# Altium schematic sheet AmplifierDclass_Bridge.SchDoc
size 420 x 297 mm; DocumentNumber: Введите номер платы + Э3; SheetNumber: номер страницы; Format: A3
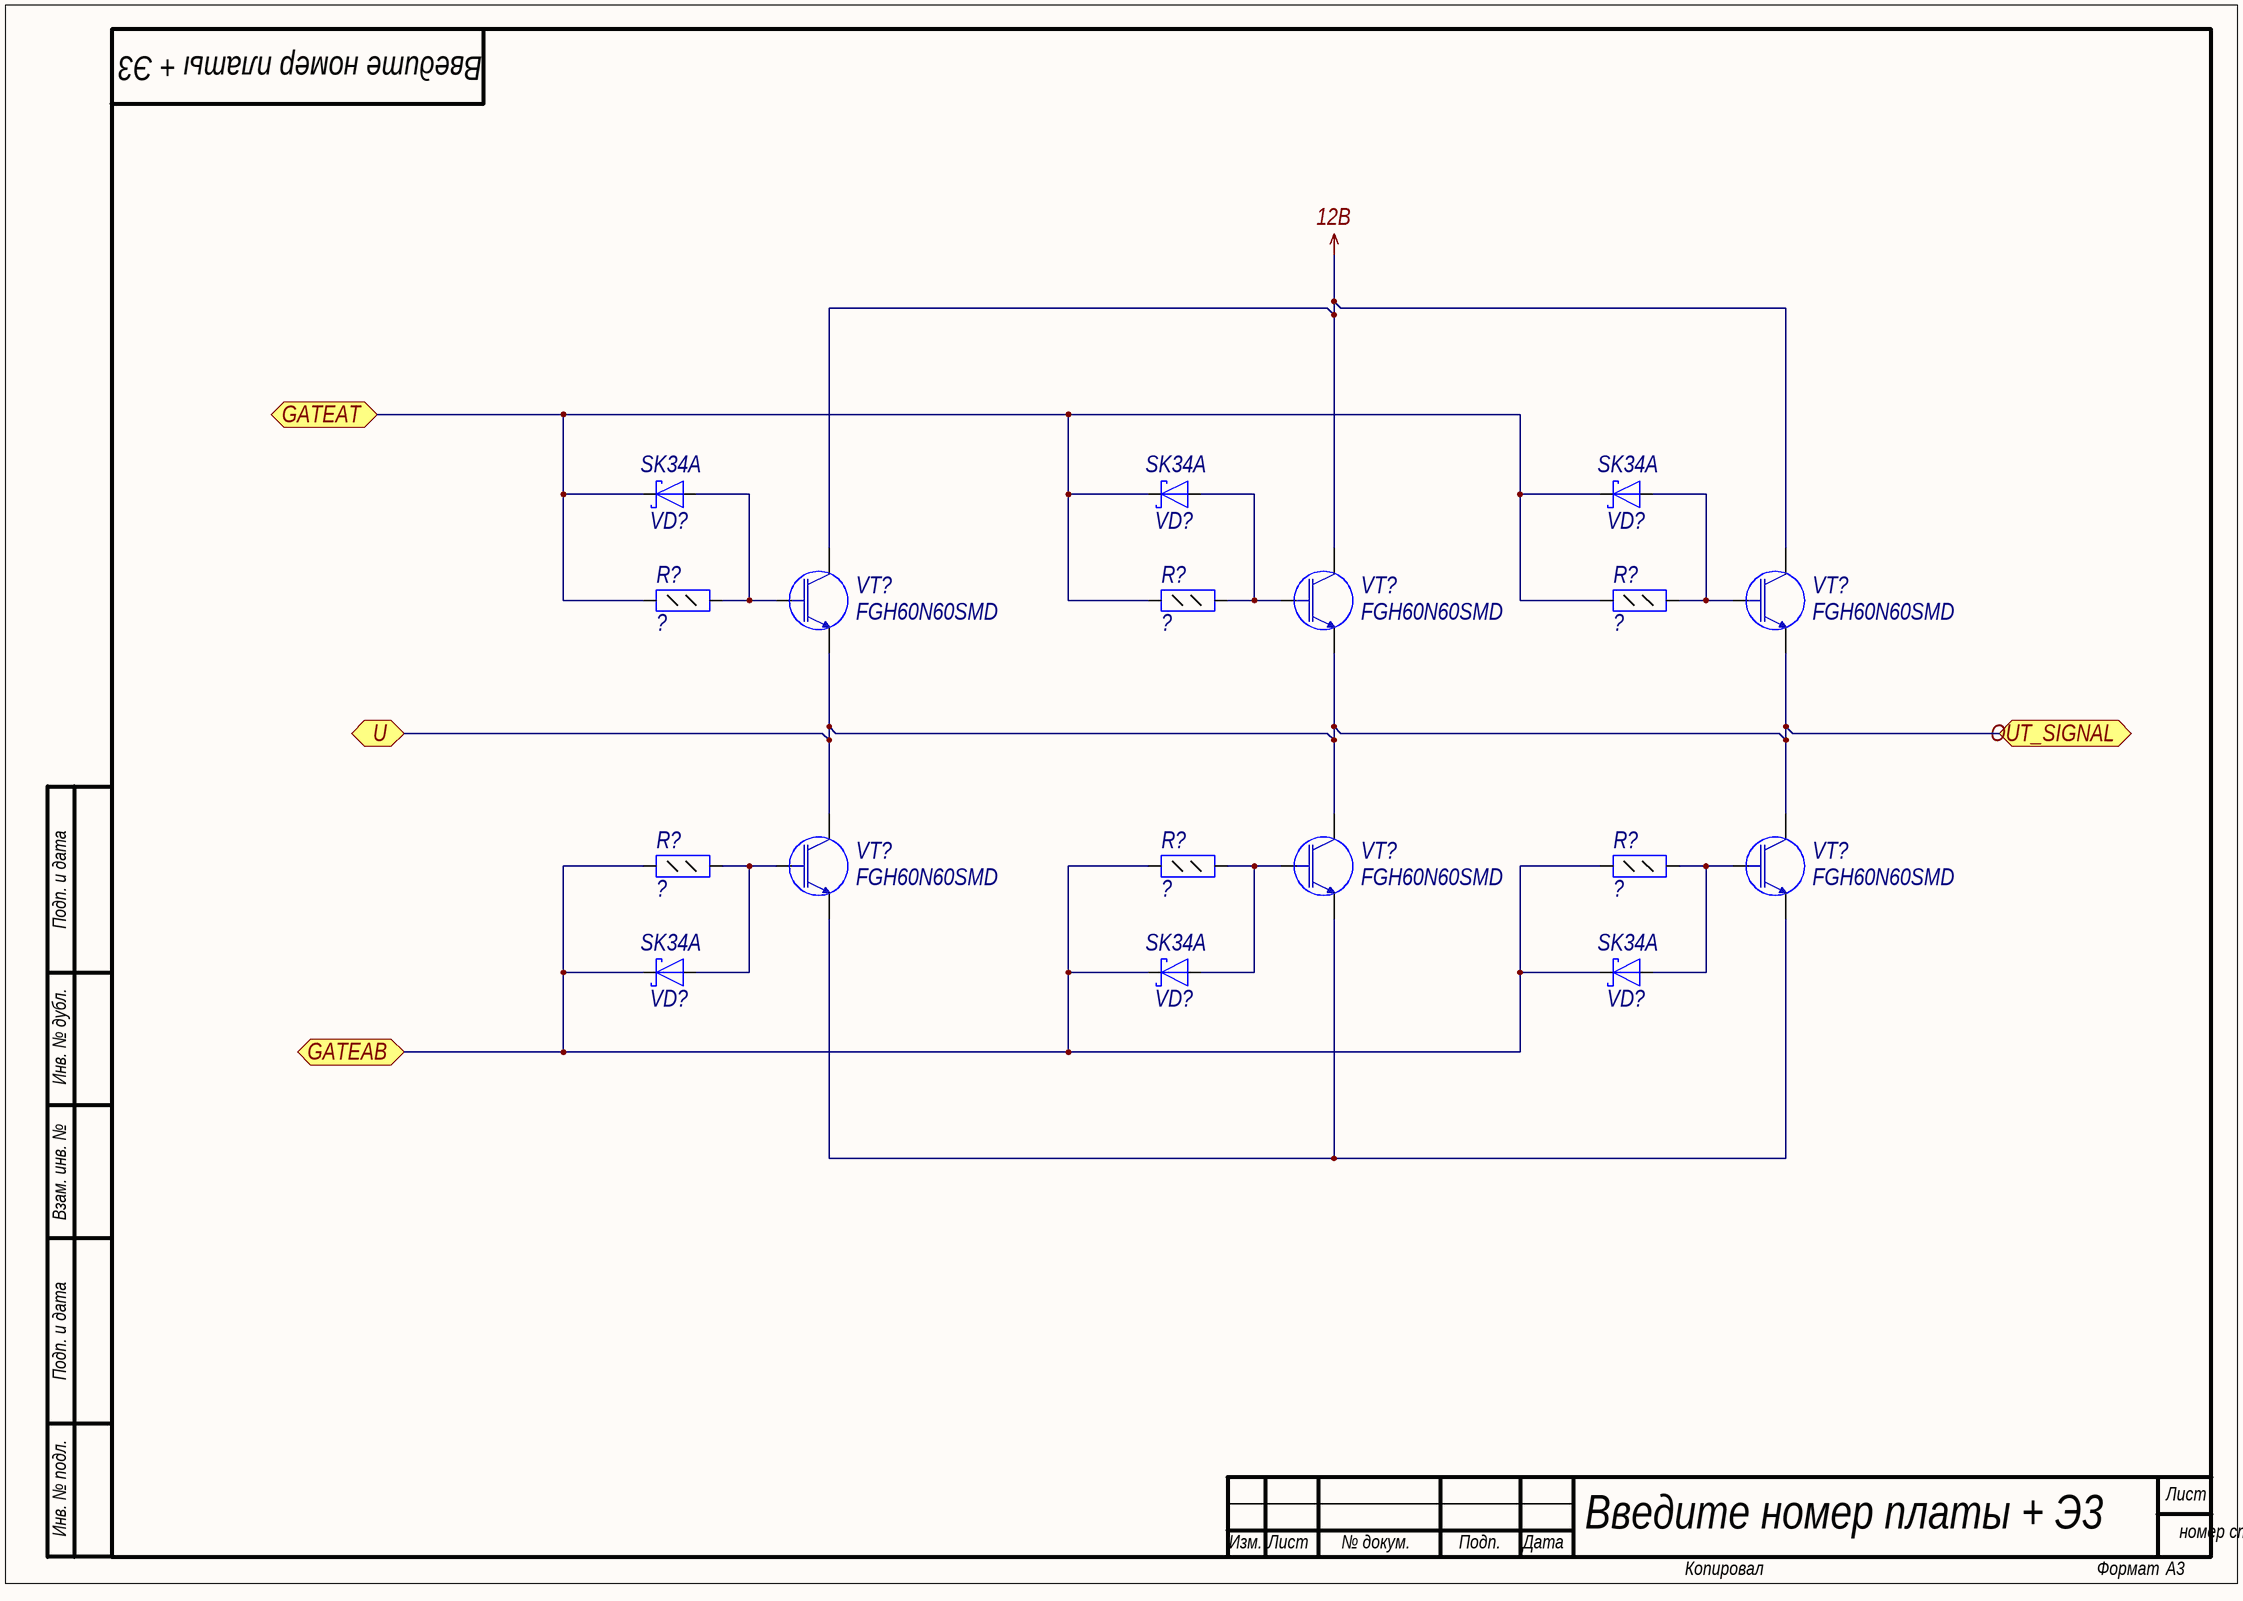
[diagram p0: AmplifierDclass_Bridge.SchDoc]

## Parts
(Parts that share a designator on the sheet are numbered #1, #2 ... from top to bottom, then left to right.)
R?#1  Resistor_0,125Вт  [R0805]  (value not drawn)
R?#2  Resistor_0,125Вт  [R0805]  (value not drawn)
R?#3  Resistor_0,125Вт  [R0805]  (value not drawn)
R?#4  Resistor_0,125Вт  [R0805]  (value not drawn)
R?#5  Resistor_0,125Вт  [R0805]  (value not drawn)
R?#6  Resistor_0,125Вт  [R0805]  (value not drawn)
VD?#1  Part Number: SK34A  [SMA]  (hidden comment: DiodeSchottky)
VD?#2  Part Number: SK34A  [SMA]  (hidden comment: DiodeSchottky)
VD?#3  Part Number: SK34A  [SMA]  (hidden comment: DiodeSchottky)
VD?#4  Part Number: SK34A  [SMA]  (hidden comment: DiodeSchottky)
VD?#5  Part Number: SK34A  [SMA]  (hidden comment: DiodeSchottky)
VD?#6  Part Number: SK34A  [SMA]  (hidden comment: DiodeSchottky)
VT?#1  Part Number: FGH60N60SMD  [TO-247_V]  (hidden comment: IGBT)
VT?#2  Part Number: FGH60N60SMD  [TO-247_V]  (hidden comment: IGBT)
VT?#3  Part Number: FGH60N60SMD  [TO-247_V]  (hidden comment: IGBT)
VT?#4  Part Number: FGH60N60SMD  [TO-247_V]  (hidden comment: IGBT)
VT?#5  Part Number: FGH60N60SMD  [TO-247_V]  (hidden comment: IGBT)
VT?#6  Part Number: FGH60N60SMD  [TO-247_V]  (hidden comment: IGBT)

## Ports
GATEAB, GATEAT, OUT_SIGNAL, U

## Nets
12B: VT?#1.2(С) VT?#2.2(С) VT?#3.2(С)
GATEAB: R?#4.1 R?#5.1 R?#6.1 VD?#4.1(K) VD?#5.1(K) VD?#6.1(K) ; port GATEAB
GATEAT: R?#1.1 R?#2.1 R?#3.1 VD?#1.1(K) VD?#2.1(K) VD?#3.1(K) ; port GATEAT
OUT_SIGNAL: VT?#1.3(E) VT?#2.3(E) VT?#3.3(E) VT?#4.2(С) VT?#5.2(С) VT?#6.2(С) ; port U, port OUT_SIGNAL
NetR?#1_2: R?#1.2 VD?#1.2(A) VT?#1.1(G)
NetR?#2_2: R?#2.2 VD?#2.2(A) VT?#2.1(G)
NetR?#3_2: R?#3.2 VD?#3.2(A) VT?#3.1(G)
NetR?#4_2: R?#4.2 VD?#4.2(A) VT?#4.1(G)
NetR?#5_2: R?#5.2 VD?#5.2(A) VT?#5.1(G)
NetR?#6_2: R?#6.2 VD?#6.2(A) VT?#6.1(G)
NetVT?#4_3: VT?#4.3(E) VT?#5.3(E) VT?#6.3(E)

## Notes on the sheet
- Подп. и дата
- Инв. № дубл.
- Взам. инв. №
- Инв. № подл.
- Лист
- Изм.
- № докум.
- Подп.
- Дата
- Копировал
- Формат

## Library data of the parts
R?#1-R?#6 = res41: Резистор; Manufacture: Yageo; Part Number: RC0805FR-0747RL; id: res41; Accuracy: 0.01; Value: ?; Part Name: Resistor; Power: 0,125Вт
VD?#1-VD?#6 = diode1: Диод Шоттки; Manufacture: Taiwan Semiconductor; id: diode1; Max Reverse Voltage: 40B; Forward Voltage: 0,55B; Forward Current: 3A; Part Name: Diode Schottky
VT?#1-VT?#6 = FGH60N60SMD: Manufacturer: Fairchild; id: igbt0; V collector-emitter max: 600B; Gate treshold voltage: 6B(15A)-7B(45A)-8B(75A); Gate-to-emmiter voltage: (+-)20B; Total gate charge: 189 nC; Continuous collector current: 120A; Pulsed collector current: 180A; Power dissipation: 600W